# EAGLE schematic accel_v1.0 (EAGLE 5.11)
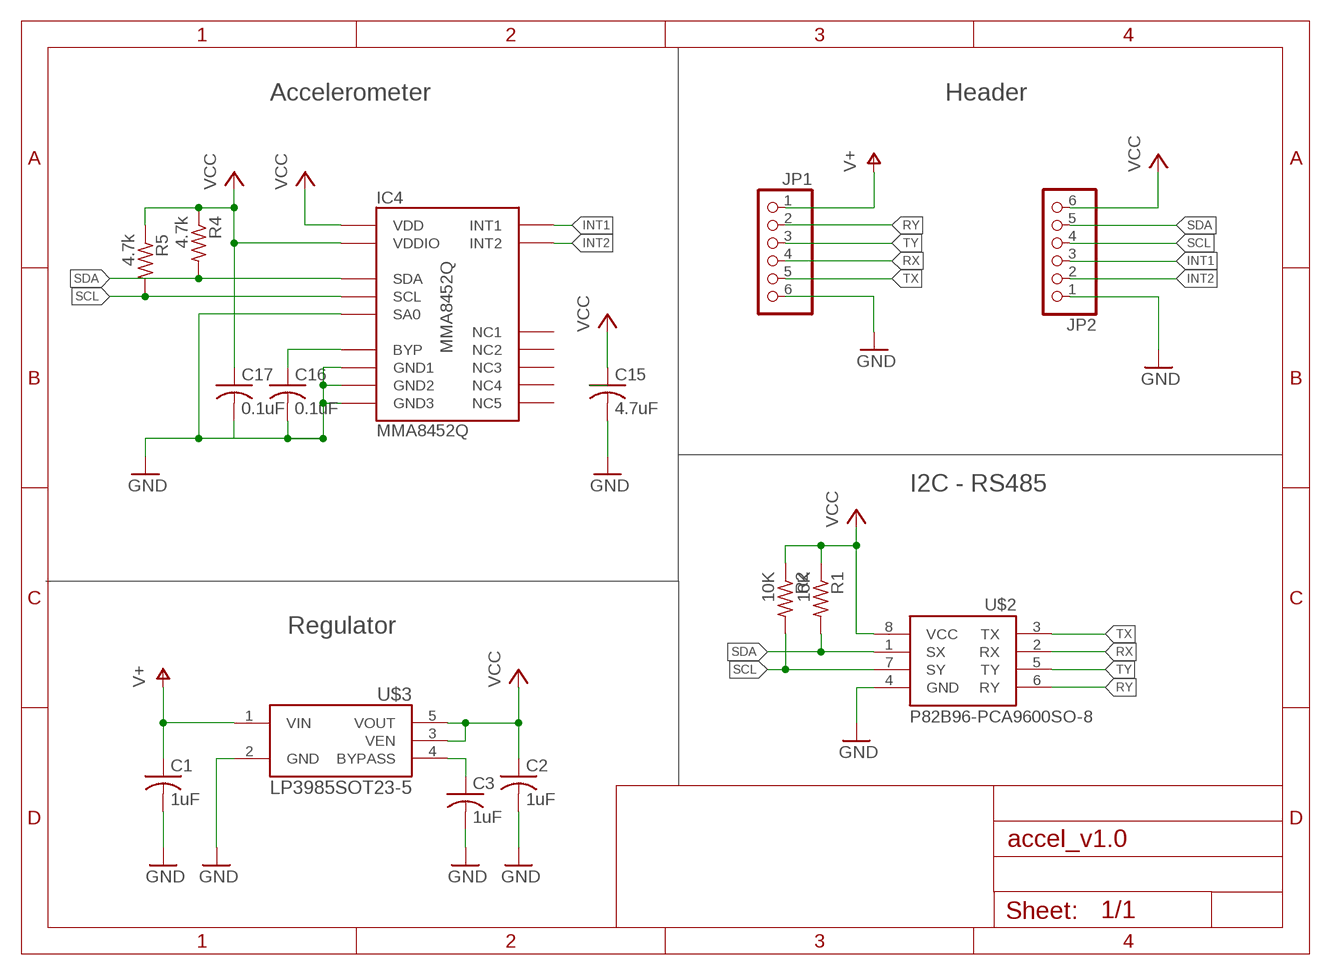
[diagram p0: schematic, sheet 1]

## Parts
C1  1uF  C-USC0603  [C0603]
C2  1uF  C-USC0603  [C0603]
C3  1uF  C-USC0603  [C0603]
C15  4.7uF  C-USC0603  [C0603]
C16  0.1uF  C-USC0603  [C0603]
C17  0.1uF  C-USC0603  [C0603]
IC4  MMA8452Q  [QFN-16]
JP1  PINHD-1X6  [1X06]
JP2  PINHD-1X6  [1X06]
R1  10K  R-US_R0603  [R0603]
R2  10K  R-US_R0603  [R0603]
R4  4.7k  R-US_R0603  [R0603]
R5  4.7k  R-US_R0603  [R0603]
U$2  P82B96-PCA9600SO-8  [SO-8]
U$3  LP3985SOT23-5  [SOT23-5]

## Nets
GND: C1.2 C2.2 C3.2 C15.2 C16.2 C17.2 IC4.PIN5(GND1) IC4.PIN7(SA0) IC4.PIN10(GND2) IC4.PIN12(GND3) JP1.6 JP2.1 U$2.4(GND) U$3.2(GND)
INT1: IC4.PIN11(INT1) JP2.3
INT2: IC4.PIN9(INT2) JP2.2
N$8: C3.1 U$3.4(BYPASS)
N$16: C16.1 IC4.PIN2(BYP)
RX: JP1.4 U$2.2(RX)
RY: JP1.2 U$2.6(RY)
SCL: IC4.PIN4(SCL) JP2.4 R2.2 R5.2 U$2.7(SY)
SDA: IC4.PIN6(SDA) JP2.5 R1.2 R4.2 U$2.1(SX)
TX: JP1.5 U$2.3(TX)
TY: JP1.3 U$2.5(TY)
V+: C1.1 JP1.1 U$3.1(VIN)
VCC: C2.1 C15.1 C17.1 IC4.PIN1(VDDIO) IC4.PIN14(VDD) JP2.6 R1.1 R2.1 R4.1 R5.1 U$2.8(VCC) U$3.3(VEN) U$3.5(VOUT)
Unconnected: IC4.PIN3(NC1) IC4.PIN8(NC2) IC4.PIN13(NC3) IC4.PIN15(NC4) IC4.PIN16(NC5)

## Notes on the sheet
- Accelerometer | Header
- I2C - RS485
- Regulator

## Library data of the parts
C1-C3 C15-C17 = rcl:C-US: CAPACITOR, American symbol
IC4 = eski-ic:MMA8452Q: Three axis I2C accelerometer.
JP1 JP2 = pinhead:PINHD-1X6: PIN HEADER
R1 R2 R4 R5 = rcl:R-US_: RESISTOR, American symbol
U$2 = Sparky:P82B96-PCA9600: P822B96 and PCA9600, bipolar IC creating a non-latching, bidirectional, logic interface between the normal I2C bus and a range of other bus configuration icluding rs485.
U$3 = Sparky:LP3985